# EAGLE schematic Arduino Engine Room (EAGLE 6.2)
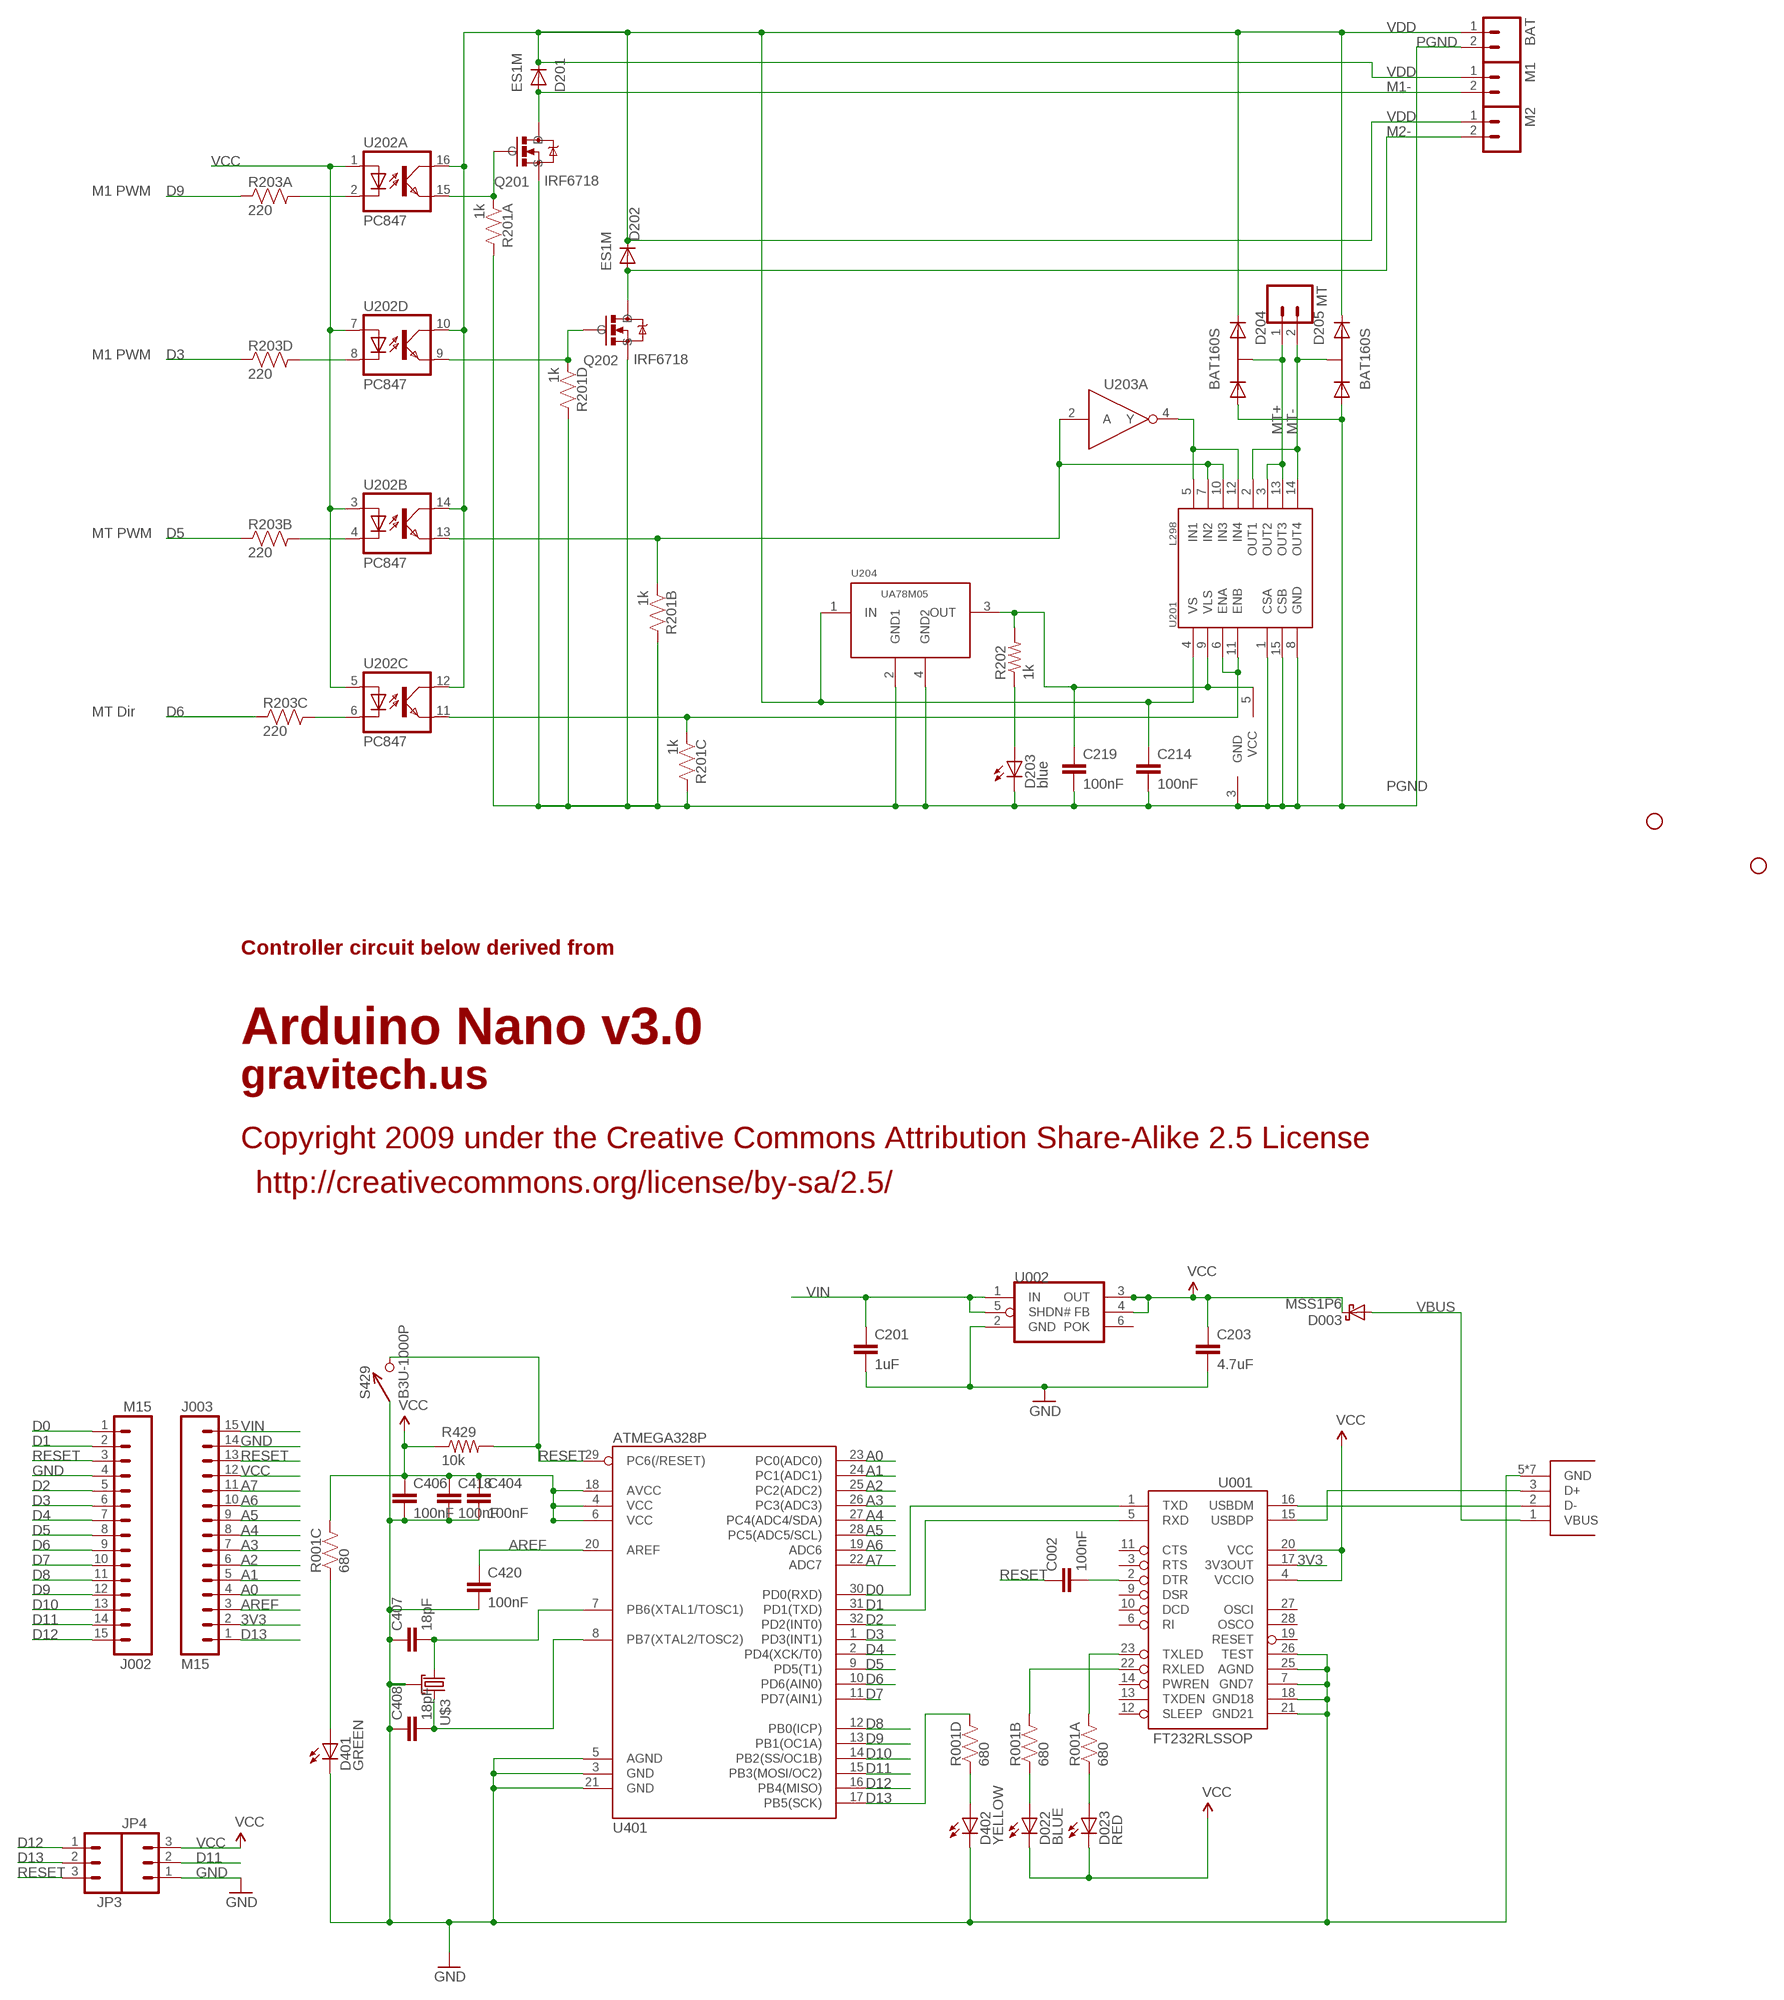
[diagram p0: schematic, sheet 1]

## Parts
BAT  M02PTH4  [1X02_XTRA_BIG]
C002  100nF  CAP0402-CAP  [0402-CAP]
C201  1uF  CAP0402-CAP  [0402-CAP]
C203  4.7uF  CAP0402-CAP  [0402-CAP]
C214  100nF  CAP0402-CAP  [0402-CAP]
C219  100nF  CAP0402-CAP  [0402-CAP]
C404  100nF  CAP0402-CAP  [0402-CAP]
C406  100nF  CAP0402-CAP  [0402-CAP]
C407  18pF  CAP0402-CAP  [0402-CAP]
C408  18pF  CAP0402-CAP  [0402-CAP]
C418  100nF  CAP0402-CAP  [0402-CAP]
C420  100nF  CAP0402-CAP  [0402-CAP]
D003  MSS1P6  [MICROSMP]
D022  BLUE  LED0603  [LED-0603]
D023  RED  LED0603  [LED-0603]
D201  ES1M  DIODE-DO-214AC  [DO-214AC]
D202  ES1M  DIODE-DO-214AC  [DO-214AC]
D203  blue  LED0603  [LED-0603]
D204  BAT160S  [SOT-223]
D205  BAT160S  [SOT-223]
D401  GREEN  LED0603  [LED-0603]
D402  YELLOW  LED0603  [LED-0603]
J001  USB_MICROB_JST  [UB-MC5BR3-SD204-4S]
J002  M15  [1X15]
J003  M15  [1X15]
JP1  STAND-OFF  [STAND-OFF]
JP2  STAND-OFF  [STAND-OFF]
JP3  M03PTH  [1X03]
JP4  M03PTH  [1X03]
M1  M02PTH4  [1X02_XTRA_BIG]
M2  M02PTH4  [1X02_XTRA_BIG]
MT  M02PTH  [1X02]
Q201  IRF6718  [DIRECTFET_L6]
Q202  IRF6718  [DIRECTFET_L6]
R001  680  RP404  [CRA04]
R201  1k  RP404  [CRA04]
R202  1k  RESISTOR0402-RES  [0402-RES]
R203  220  RP404  [CRA04]
R429  10k  RESISTOR0402-RES  [0402-RES]
S429  B3U-1000P  [B3U-1000P]
U001  FT232RLSSOP  [SSOP28DB]
U002  MAX8881  [SOT-23-6]
U201  L298  [MULTIWATT15]
U202  PC847  [DIL16]
U203  MC74VHC1G04  [SOT-23-5]
U204  UA78M05  [SOT223]
U401  ATMEGA328P  ATMEGA168  [TQFP32-08]
U$3  CX2520  [CRYSTAL_SMD_2MM_2_5MM]

## Nets
3V3: J003.2 U001.17(3V3OUT)
A0: J003.4 U401.23(PC0(ADC0))
A1: J003.5 U401.24(PC1(ADC1))
A2: J003.6 U401.25(PC2(ADC2))
A3: J003.7 U401.26(PC3(ADC3))
A4: J003.8 U401.27(PC4(ADC4/SDA))
A5: J003.9 U401.28(PC5(ADC5/SCL))
A6: J003.10 U401.19(ADC6)
A7: J003.11 U401.22(ADC7)
AREF: C420.1 J003.3 U401.20(AREF)
D0: J002.1 U001.1(TXD) U401.30(PD0(RXD))
D1: J002.2 U001.5(RXD) U401.31(PD1(TXD))
D2: J002.5 U401.32(PD2(INT0))
D3: J002.6 R203.4 U401.1(PD3(INT1))
D4: J002.7 U401.2(PD4(XCK/T0))
D5: J002.8 R203.2 U401.9(PD5(T1))
D6: J002.9 R203.3 U401.10(PD6(AIN0))
D7: J002.10 U401.11(PD7(AIN1))
D8: J002.11 U401.12(PB0(ICP))
D9: J002.12 R203.1 U401.13(PB1(OC1A))
D10: J002.13 U401.14(PB2(SS/OC1B))
D11: J002.14 JP4.2 U401.15(PB3(MOSI/OC2))
D12: J002.15 JP3.1 U401.16(PB4(MISO))
D13: J003.1 JP3.2 R001.5 U401.17(PB5(SCK))
DTR#: C002.2 U001.2(DTR)
GND: C201.2 C203.2 C404.2 C406.2 C407.1 C408.1 C418.2 C420.2 D401.C D402.C J001.5(GND) J001.P$6(GND) J001.P$7(GND) J001.P$8(GND) J001.P$9(GND) J001.P$10(GND) J001.P$11(GND) J002.4 J003.14 JP4.1 S429.P$1 U001.7(GND7) U001.18(GND18) U001.21(GND21) U001.25(AGND) U001.26(TEST) U002.2(GND) U401.3(GND) U401.5(AGND) U401.21(GND) U$3.2 U$3.4
M1- [power]: D201.A M1.2 Q201.D1(D) Q201.D2(D)
M2- [power]: D202.A M2.2 Q202.D1(D) Q202.D2(D)
MT+ [lt_power]: D204.4(K1A2) MT.1 U201.3(OUT2) U201.13(OUT3)
MT- [lt_power]: D205.4(K1A2) MT.2 U201.2(OUT1) U201.14(OUT4)
N$1: D203.A R202.1
N$2: U201.5(IN1) U201.12(IN4) U203.4(A:Y)
N$3: C407.2 U401.7(PB6(XTAL1/TOSC1)) U$3.1
N$4: C408.2 U401.8(PB7(XTAL2/TOSC2)) U$3.3
N$5: J001.3(D+) U001.15(USBDP)
N$6: J001.2(D-) U001.16(USBDM)
N$7: D401.A R001.3
N$8: D402.A R001.4
N$9: D023.A R001.1
N$10: C219.1 R202.2 U201.9(VLS) U203.5(PWR:VCC) U204.3(OUT)
N$11: D022.A R001.2
N$28: R201.3 U201.6(ENA) U201.11(ENB) U202.11(C:EMIT)
N$31: R203.8 U202.2(A:C)
N$32: R203.5 U202.8(D:C)
N$33: R203.7 U202.4(B:C)
N$34: R203.6 U202.6(C:C)
N$35: Q201.G R201.1 U202.15(A:EMIT)
N$36: Q202.G R201.4 U202.9(D:EMIT)
N$37: R201.2 U201.7(IN2) U201.10(IN3) U202.13(B:EMIT) U203.2(A:A)
PGND [power]: BAT.2 C214.2 C219.2 D203.C D204.1(A1) D205.1(A1) Q201.S Q202.S R201.5 R201.6 R201.7 R201.8 U201.1(CSA) U201.8(GND) U201.15(CSB) U203.3(PWR:GND) U204.2(GND1) U204.4(GND2)
RESET: C002.1 J002.3 J003.13 JP3.3 R429.2 S429.P$2 U401.29(PC6(/RESET))
RXLED1: R001.7 U001.22(RXLED)
TXLED1: R001.8 U001.23(TXLED)
VBUS: D003.A J001.1(VBUS)
VCC: C203.1 C404.1 C406.1 C418.1 D003.K D022.C D023.C J003.12 JP4.3 R001.6 R429.1 U001.4(VCCIO) U001.20(VCC) U002.3(OUT) U002.4(FB) U202.1(A:A) U202.3(B:A) U202.5(C:A) U202.7(D:A) U401.4(VCC) U401.6(VCC) U401.18(AVCC)
VDD [power]: BAT.1 C214.1 D201.C D202.C D204.3(K2) D205.3(K2) M1.1 M2.1 U201.4(VS) U202.10(D:COL) U202.12(C:COL) U202.14(B:COL) U202.16(A:COL) U204.1(IN)
VIN: C201.1 J003.15 U002.1(IN) U002.5(SHDN#)
Unconnected: U001.3(RTS) U001.6(RI) U001.9(DSR) U001.10(DCD) U001.11(CTS) U001.12(SLEEP) U001.13(TXDEN) U001.14(PWREN) U001.19(RESET) U001.27(OSCI) U001.28(OSCO) U002.6(POK)

## Notes on the sheet
- M1 PWM
- M1 PWM
- MT PWM
- MT Dir
- Controller circuit below derived from
- Arduino Nano v3.0
- gravitech.us
- Copyright 2009 under the Creative Commons Attribution Share-Alike 2.5 License
- http://creativecommons.org/license/by-sa/2.5/

## Library data of the parts
BAT M1 M2 MT = SparkFun:M02: Header 2 Standard 2-pin 0.1" header. Use with straight break away headers (SKU : PRT-00116), right angle break away headers (PRT-00553), swiss pins (PRT-00743), machine pins (PRT-00117), and female headers (PRT-00115). Molex polarized connector foot print use with SKU : PRT-08233 with associated crimp pins and housings.
C002 C404 C406 C418 C420 = SparkFun:CAP: Capacitor Standard 0603 ceramic capacitor, and 0.1" leaded capacitor.; DIGIKEY: 445-1268-1-ND
C201 = SparkFun:CAP: Capacitor Standard 0603 ceramic capacitor, and 0.1" leaded capacitor.; DIGIKEY: 445-1415-1-ND
C203 = SparkFun:CAP: Capacitor Standard 0603 ceramic capacitor, and 0.1" leaded capacitor.; DIGIKEY: 445-7395-1-ND
C214 C219 = SparkFun:CAP: Capacitor Standard 0603 ceramic capacitor, and 0.1" leaded capacitor.
C407 C408 = SparkFun:CAP: Capacitor Standard 0603 ceramic capacitor, and 0.1" leaded capacitor.; DIGIKEY: 445-1238-1-ND
D003 = KwanSystems:MSS1P6; DIGIKEY: MSS1P6-M3/89AGICT-ND
D022 = SparkFun-LED:LED: LEDs Standard schematic elements and footprints for 5mm, 3mm, 1206, and 0603 sized LEDs. 5mm - Spark Fun Electronics SKU : COM-00529 (and others); DIGIKEY: 350-2037-1-ND
D023 = SparkFun-LED:LED: LEDs Standard schematic elements and footprints for 5mm, 3mm, 1206, and 0603 sized LEDs. 5mm - Spark Fun Electronics SKU : COM-00529 (and others); DIGIKEY: 754-1359-1-ND
D201 D202 = diode:DIODE-: DIODE
D203 = SparkFun:LED: LEDs Standard schematic elements and footprints for 5mm, 3mm, 1206, and 0603 sized LEDs. 5mm - Spark Fun Electronics SKU : COM-00529 (and others)
D204 D205 = KwanSystems:BAT160S
D401 = SparkFun-LED:LED: LEDs Standard schematic elements and footprints for 5mm, 3mm, 1206, and 0603 sized LEDs. 5mm - Spark Fun Electronics SKU : COM-00529 (and others); DIGIKEY: 350-2036-1-ND
D402 = SparkFun-LED:LED: LEDs Standard schematic elements and footprints for 5mm, 3mm, 1206, and 0603 sized LEDs. 5mm - Spark Fun Electronics SKU : COM-00529 (and others); DIGIKEY: 754-1124-1-ND
J001 = KwanSystems:USB_MICROB_JST; DIGIKEY: 455-2562-1-ND
J002 J003 = SparkFun-Connectors:M15: Header 15 Standard 15-pin 0.1" header. Use with straight break away headers (SKU : PRT-00116), right angle break away headers (PRT-00553), swiss pins (PRT-00743), machine pins (PRT-00117), and female headers (PRT-00115).; DIGIKEY: $NOPART
JP1 JP2 = SparkFun:STAND-OFF: Stand Off This is the mechanical footprint for a #4 phillips button head screw. Use the keepout ring to avoid running the screw head into surrounding components. SKU : PRT-00447
JP3 JP4 = SparkFun-Connectors:M03: Header 3 Standard 3-pin 0.1" header. Use with straight break away headers (SKU : PRT-00116), right angle break away headers (PRT-00553), swiss pins (PRT-00743), machine pins (PRT-00117), and female headers (PRT-00115). Molex polarized connector foot print use with SKU : PRT-08232 with associated crimp pins and housings.; DIGIKEY: $NOPART
Q201 Q202 = KwanSystems:IRF6718
R001 = KwanSystems:RP4; DIGIKEY: CRA4S8680CT-ND
R201 R203 = KwanSystems:RP4
R202 = SparkFun:RESISTOR: Resistor Basic schematic elements and footprints for 0603, 1206, and PTH resistors.
R429 = SparkFun-Passives:RESISTOR: Resistor Basic schematic elements and footprints for 0603, 1206, and PTH resistors.; DIGIKEY: P10.0KLCT-ND
S429 = KwanSystems:B3U-1000P
U001 = SparkFun-DigitalIC:FT232RL: USB UART FT232RL 4th Generation USB UART (USB <-> Serial) Controller. Spark Fun Electronics SKU : COM-00650; DIGIKEY: 768-1007-1-ND
U002 = KwanSystems:MAX8881; DIGIKEY: MAX8881EUT50+TCT-ND
U201 = SparkFun:L298: L298 Dual Full Bridge Driver
U202 = optocoupler:PC847: SHARP OPTO COUPLER
U203 = KwanSystems:MC74VHC1G04
U204 = MySMD:UA78M05
U401 = SparkFun-DigitalIC:ATMEGA168: Atmel 32-pin 8-bit micro, 16k flash.; DIGIKEY: ATMEGA328P-15AZCT-ND
U$3 = KwanSystems:CX2520

## Net classes
0 default: width 0.152 mm, drill 0.33 mm, clearance 0.152 mm
1 power: width 0.152 mm, drill 0.33 mm, clearance 0.152 mm to class 0, clearance 0.152 mm
2 lt_power: width 0.152 mm, drill 0.33 mm, clearance 0.254 mm to class 0, clearance 0.254 mm to class 1, clearance 0.254 mm